# EAGLE design perfboard-tinyprog (EAGLE 5.06)
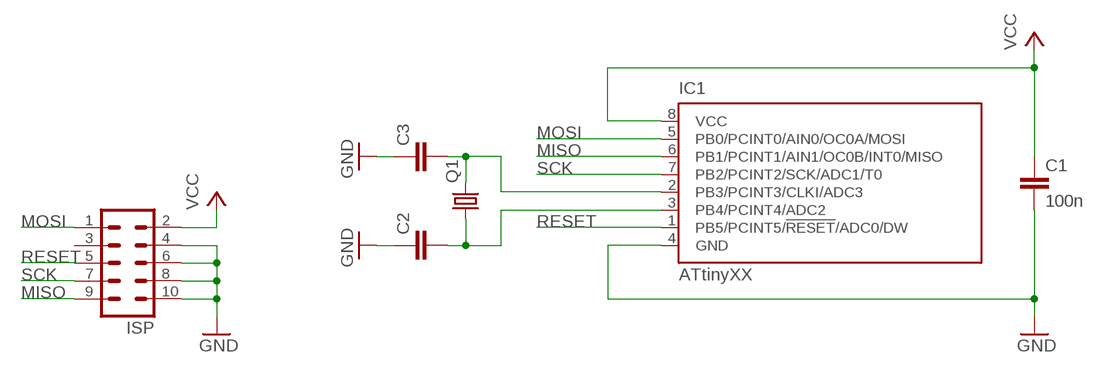
[diagram p0: schematic, sheet 1]

## Parts
C1  100n  C-EU102-043X133  [C102-043X133]
C2  C-EU050-024X044  [C050-024X044]
C3  C-EU050-024X044  [C050-024X044]
IC1  ATtinyXX  TINY13-20PU  [DIL08]
ISP  ML10  [ML10]
Q1  CRYSTALHC49S  [HC49/S]

## Nets
GND: C1.2 C2.1 C3.1 IC1.4(GND) ISP.4 ISP.6 ISP.8 ISP.10
MISO: IC1.6(PB1/PCINT1/AIN1/OC0B/INT0/MISO) ISP.9
MOSI: IC1.5(PB0/PCINT0/AIN0/OC0A/MOSI) ISP.1
N$5: C3.2 IC1.2(PB3/PCINT3/CLKI/ADC3) Q1.2
N$6: C2.2 IC1.3(PB4/PCINT4/ADC2) Q1.1
RESET: IC1.1(PB5/PCINT5/!RESET!/ADC0/DW) ISP.5
SCK: IC1.7(PB2/PCINT2/SCK/ADC1/T0) ISP.7
VCC: C1.1 IC1.8(VCC) ISP.2
Unconnected: ISP.3

## Library data of the parts
C1-C3 = rcl:C-EU: CAPACITOR, European symbol
IC1 = atmel:TINY13: 8-bit AVR Microcontroller with 1K Bytes In-System Programmable Flash Source: http://www.atmel.com/dyn/resources/prod_documents/2535S.pdf
ISP = con-harting-ml:ML10: HARTING
Q1 = crystal:CRYSTAL: CRYSTAL

## Board
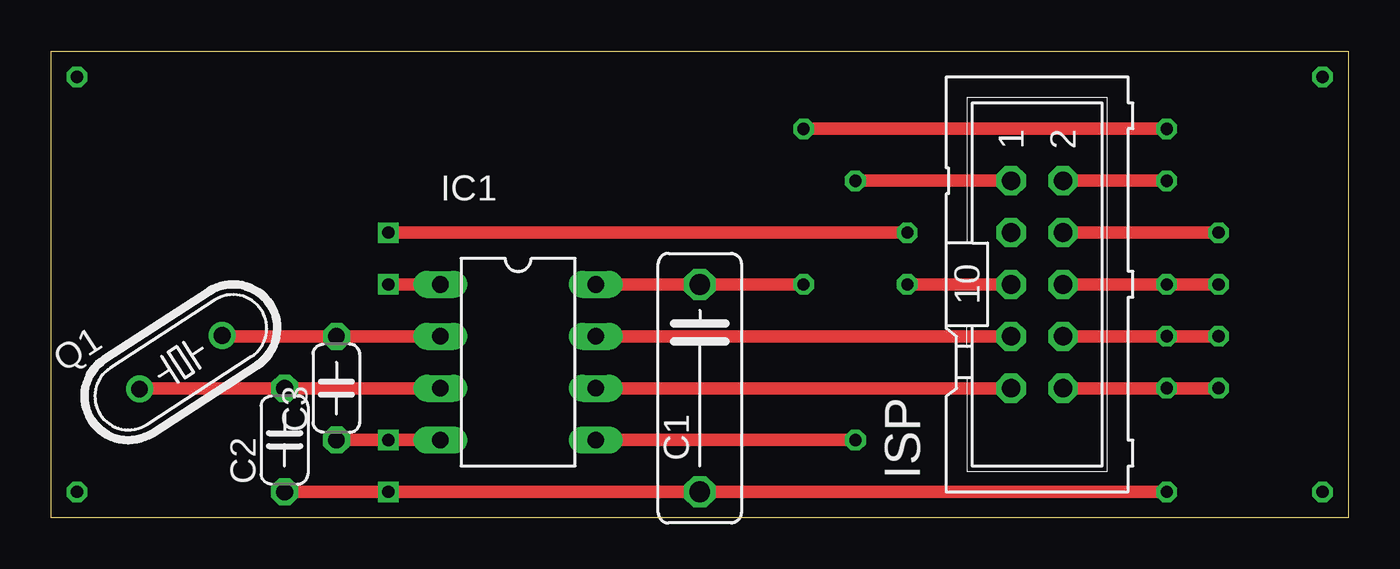
[diagram p1: board, top side]
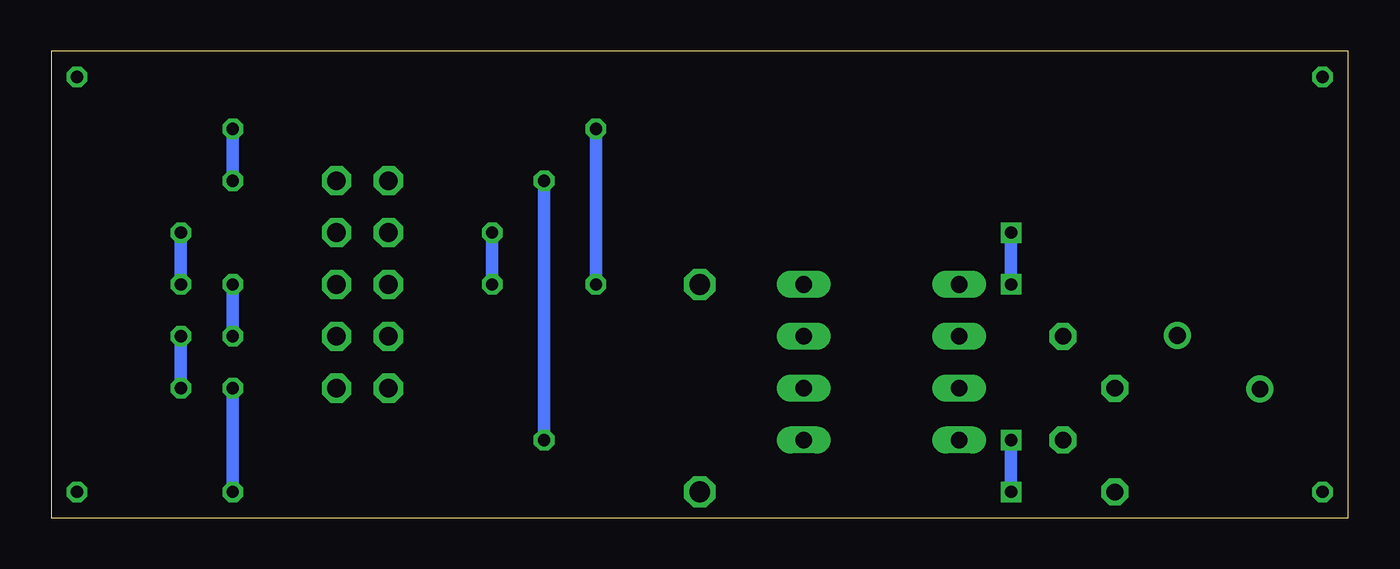
[diagram p2: board, bottom side, seen from below]

Size 63.5 x 22.86 mm. Coordinates in mm from the lower left corner, seen from the top.
Outline: 0,0 0,22.86 63.5,22.86 63.5,0 0,0
Copper layers (1*16): Top 0.035mm / dielectric 1.5mm / Bottom 0.035mm
Design rules "default": minimum track width 10mil, minimum drill 24mil, track to track 8mil, track to pad 8mil, pad to pad 8mil, via to via 8mil, smd to smd 8mil, copper to edge 40mil, drill to drill 8mil, minimum pad ring 10mil, minimum via ring 8mil, stop-mask expansion 4mil, vias tented up to drill 0mil, thermal gap 10mil

### Footprints (pad centres in the part's own frame; a part is rotated, then mirrored left to right if it is on the bottom)
C102-043X133 = drill 1.016 octagon: 1 -5.08,0; 2 5.08,0
C050-024X044 = drill 0.813 octagon: 1 -2.54,0; 2 2.54,0
DIL08 = drill 0.813 long: 1 -3.81,-3.81; 2 -1.27,-3.81; 3 1.27,-3.81; 4 3.81,-3.81; 5 3.81,3.81; 6 1.27,3.81; 7 -1.27,3.81; 8 -3.81,3.81
ML10 = drill 0.914 octagon: 1 -5.08,-1.27; 2 -5.08,1.27; 3 -2.54,-1.27; 4 -2.54,1.27; 5 0,-1.27; 6 0,1.27; 7 2.54,-1.27; 8 2.54,1.27; 9 5.08,-1.27; 10 5.08,1.27
HC49/S = drill 0.813 round: 1 -2.413,0; 2 2.413,0

### Placement (x,y rotation side)
C1  31.75,6.35 270 top
C2  11.43,3.81 90 top
C3  13.97,6.35 90 top
IC1  22.86,7.62 270 top
ISP  48.26,11.43 270 top
Q1  6.35,7.62 33 top

### Tracks (layer width: path | path; a pad name or v marks a point on that pad's centre or on a via)
GND  (via drill 0.6)
  Top 0.61: v57.15,13.97 ISP.4 | ISP.10 v54.61,6.35 v57.15,6.35 | v57.15,8.89 v54.61,8.89 ISP.8 | v54.61,11.43 ISP.6 v57.15,11.43 | IC1.4 v16.51,3.81 C3.1 | C2.1 v16.51,1.27 C1.2 v54.61,1.27
  Bottom 0.61: v57.15,11.43 v57.15,13.97 | v57.15,6.35 v57.15,8.89 | v54.61,8.89 v54.61,11.43 | v16.51,1.27 v16.51,3.81 | v54.61,1.27 v54.61,6.35
MISO
  Top 0.61: IC1.6 ISP.9
MOSI  (via drill 0.6)
  Top 0.61: IC1.5 v39.37,3.81 | v39.37,16.51 ISP.1
  Bottom 0.61: v39.37,3.81 v39.37,16.51
N$1  (via drill 0.6 pad 0.81)
  other vias: 1.27,1.27
N$2  (via drill 0.6 pad 0.81)
  other vias: 1.27,21.59
N$3  (via drill 0.6 pad 0.81)
  other vias: 62.23,21.59
N$4  (via drill 0.6 pad 0.81)
  other vias: 62.23,1.27
N$5
  Top 0.61: C3.2 IC1.2 8.37,8.89 Q1.2
N$6
  Top 0.61: IC1.3 C2.2 4.33,6.35 Q1.1
RESET  (via drill 0.6)
  Top 0.61: v16.51,11.43 IC1.1 | v16.51,13.97 v41.91,13.97 | v41.91,11.43 ISP.5
  Bottom 0.61: v16.51,11.43 v16.51,13.97 | v41.91,13.97 v41.91,11.43
SCK
  Top 0.61: IC1.7 ISP.7
VCC  (via drill 0.6)
  Top 0.61: v54.61,16.51 ISP.2 | v36.83,19.05 v54.61,19.05 | v36.83,11.43 C1.1 IC1.8
  Bottom 0.61: v54.61,19.05 v54.61,16.51 | v36.83,11.43 v36.83,19.05

### Text on the board
Document: ATtiny Programmer | 1 | 1